# EasyEDA schematic Sheet_1.json
TITLE: Sheet_1; REV: 1.0; Date: 2023-02-18; Sheet: 1/1; Drawn By: venkatakrishnanr; Company: Your Company
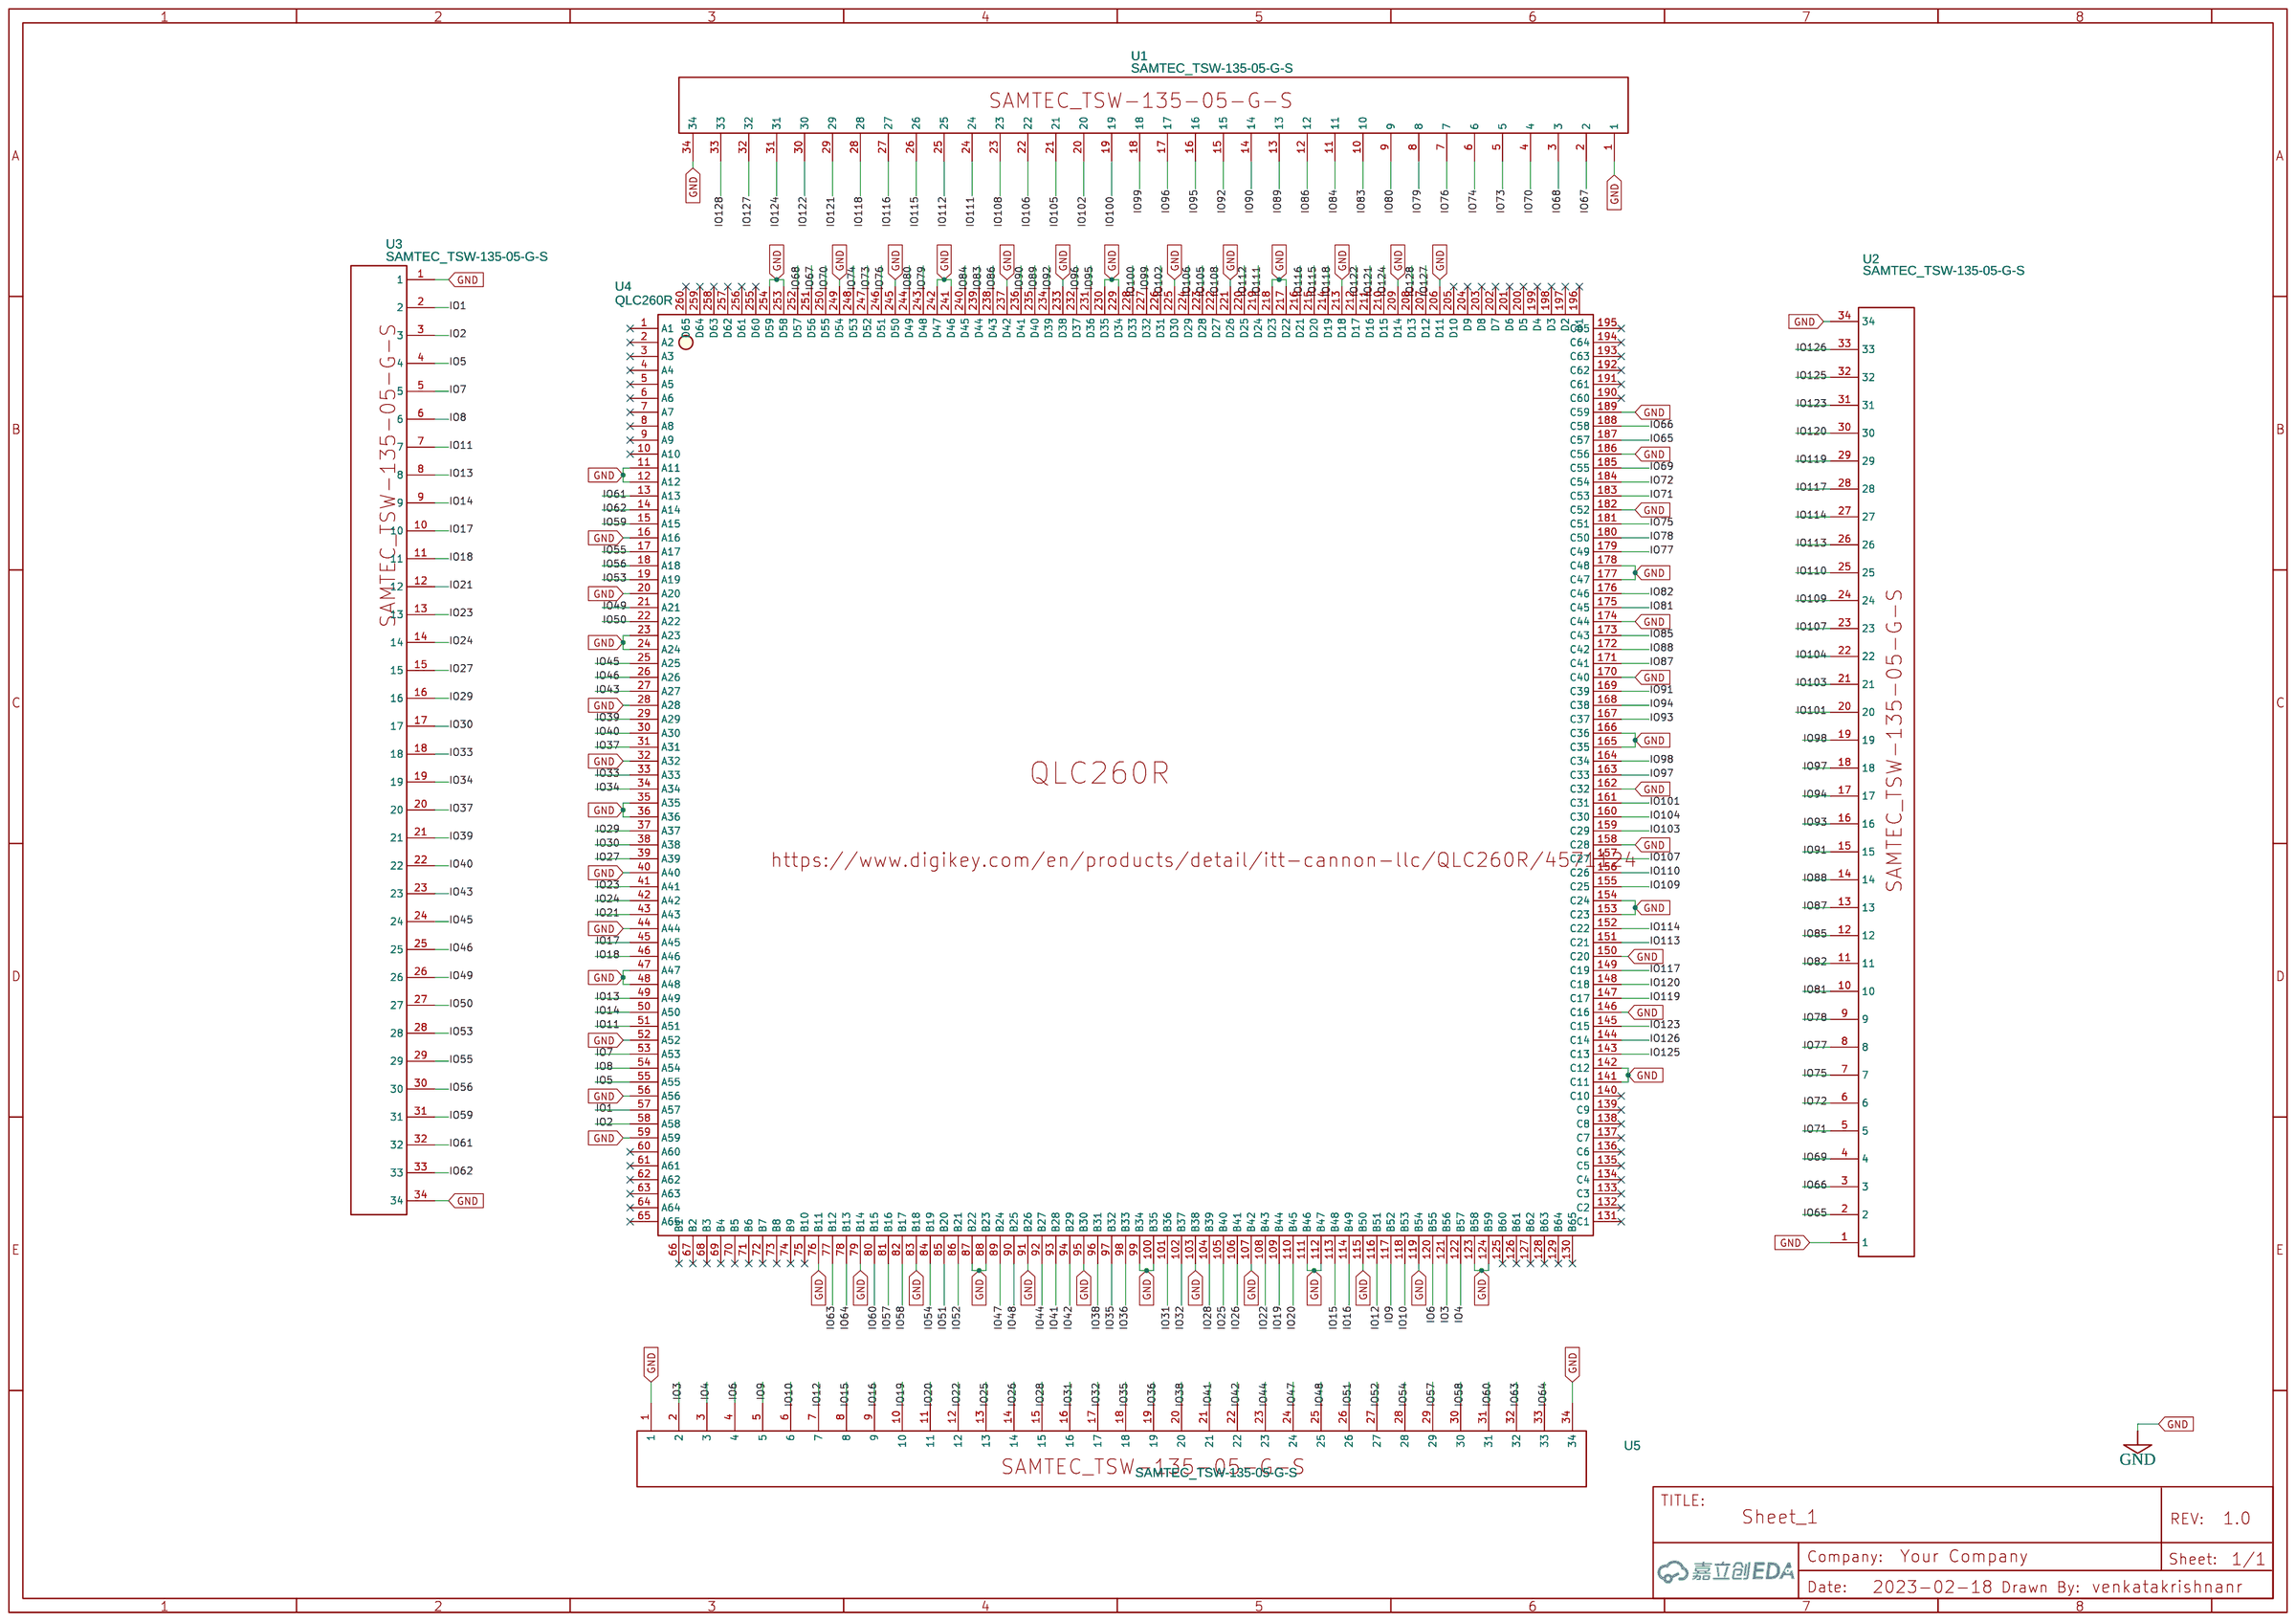
[diagram p0: schematic sheet]

## Parts
U1  SAMTEC_TSW-135-05-G-S  [CONNECTOR_01X35_SAMTECH]
U2  SAMTEC_TSW-135-05-G-S  [CONNECTOR_01X35_SAMTECH]
U3  SAMTEC_TSW-135-05-G-S  [CONNECTOR_01X35_SAMTECH]
U4  QLC260R  [QLC 260R _CONNECTOR]
U5  SAMTEC_TSW-135-05-G-S  [CONNECTOR_01X35_SAMTECH]

## Library data of the parts
U1-U3 U5 = SAMTEC_TSW-135-05-G-S: Manufacturer: Samtec Inc.; Manufacturer Part: TSW-135-05-G-S; Supplier: Digi-Key; Supplier Part: SAM1013-35-ND; link: https://www.digikey.in/en/products/detail/samtec-inc/TSW-135-05-G-S/1100486; Contributor: venkatakrishnanr
U4 = QLC260R: Manufacturer: ITT Cannon, LLC; Supplier: Digi-Key; Supplier Part: 1003-2400-ND; link: https://www.digikey.com/en/products/detail/itt-cannon-llc/QLC260R/4571124; Contributor: venkatakrishnanr

## Nets
GND: U1.1 U1.34 U2.1 U2.34 U3.1 U3.34 U4.11(A11) U4.12(A12) U4.16(A16) U4.20(A20) U4.23(A23) U4.24(A24) U4.28(A28) U4.32(A32) U4.35(A35) U4.36(A36) U4.40(A40) U4.44(A44) U4.47(A47) U4.48(A48) U4.52(A52) U4.56(A56) U4.59(A59) U4.76(B11) U4.79(B14) U4.83(B18) U4.87(B22) U4.88(B23) U4.91(B26) U4.95(B30) U4.99(B34) U4.100(B35) U4.103(B38) U4.107(B42) U4.111(B46) U4.112(B47) U4.115(B50) U4.119(B54) U4.123(B58) U4.124(B59) U4.141(C11) U4.142(C12) U4.146(C16) U4.150(C20) U4.153(C23) U4.154(C24) U4.158(C28) U4.162(C32) U4.165(C35) U4.166(C36) U4.170(C40) U4.174(C44) U4.177(C47) U4.178(C48) U4.182(C52) U4.186(C56) U4.189(C59) U4.206(D11) U4.209(D14) U4.213(D18) U4.217(D22) U4.218(D23) U4.221(D26) U4.225(D30) U4.229(D34) U4.230(D35) U4.233(D38) U4.237(D42) U4.241(D46) U4.242(D47) U4.245(D50) U4.249(D54) U4.253(D58) U4.254(D59) U5.1 U5.34
IO1: U3.2 U4.57(A57)
IO2: U3.3 U4.58(A58)
IO3: U4.121(B56) U5.2
IO4: U4.122(B57) U5.3
IO5: U3.4 U4.55(A55)
IO6: U4.120(B55) U5.4
IO7: U3.5 U4.53(A53)
IO8: U3.6 U4.54(A54)
IO9: U4.117(B52) U5.5
IO10: U4.118(B53) U5.6
IO11: U3.7 U4.51(A51)
IO12: U4.116(B51) U5.7
IO13: U3.8 U4.49(A49)
IO14: U3.9 U4.50(A50)
IO15: U4.113(B48) U5.8
IO16: U4.114(B49) U5.9
IO17: U3.10 U4.45(A45)
IO18: U3.11 U4.46(A46)
IO19: U4.109(B44) U5.10
IO20: U4.110(B45) U5.11
IO21: U3.12 U4.43(A43)
IO22: U4.108(B43) U5.12
IO23: U3.13 U4.41(A41)
IO24: U3.14 U4.42(A42)
IO25: U4.105(B40) U5.13
IO26: U4.106(B41) U5.14
IO27: U3.15 U4.39(A39)
IO28: U4.104(B39) U5.15
IO29: U3.16 U4.37(A37)
IO30: U3.17 U4.38(A38)
IO31: U4.101(B36) U5.16
IO32: U4.102(B37) U5.17
IO33: U3.18 U4.33(A33)
IO34: U3.19 U4.34(A34)
IO35: U4.97(B32) U5.18
IO36: U4.98(B33) U5.19
IO37: U3.20 U4.31(A31)
IO38: U4.96(B31) U5.20
IO39: U3.21 U4.29(A29)
IO40: U3.22 U4.30(A30)
IO41: U4.93(B28) U5.21
IO42: U4.94(B29) U5.22
IO43: U3.23 U4.27(A27)
IO44: U4.92(B27) U5.23
IO45: U3.24 U4.25(A25)
IO46: U3.25 U4.26(A26)
IO47: U4.89(B24) U5.24
IO48: U4.90(B25) U5.25
IO49: U3.26 U4.21(A21)
IO50: U3.27 U4.22(A22)
IO51: U4.85(B20) U5.26
IO52: U4.86(B21) U5.27
IO53: U3.28 U4.19(A19)
IO54: U4.84(B19) U5.28
IO55: U3.29 U4.17(A17)
IO56: U3.30 U4.18(A18)
IO57: U4.81(B16) U5.29
IO58: U4.82(B17) U5.30
IO59: U3.31 U4.15(A15)
IO60: U4.80(B15) U5.31
IO61: U3.32 U4.13(A13)
IO62: U3.33 U4.14(A14)
IO63: U4.77(B12) U5.32
IO64: U4.78(B13) U5.33
IO65: U2.2 U4.187(C57)
IO66: U2.3 U4.188(C58)
IO67: U1.2 U4.251(D56)
IO68: U1.3 U4.252(D57)
IO69: U2.4 U4.185(C55)
IO70: U1.4 U4.250(D55)
IO71: U2.5 U4.183(C53)
IO72: U2.6 U4.184(C54)
IO73: U1.5 U4.247(D52)
IO74: U1.6 U4.248(D53)
IO75: U2.7 U4.181(C51)
IO76: U1.7 U4.246(D51)
IO77: U2.8 U4.179(C49)
IO78: U2.9 U4.180(C50)
IO79: U1.8 U4.243(D48)
IO80: U1.9 U4.244(D49)
IO81: U2.10 U4.175(C45)
IO82: U2.11 U4.176(C46)
IO83: U1.10 U4.239(D44)
IO84: U1.11 U4.240(D45)
IO85: U2.12 U4.173(C43)
IO86: U1.12 U4.238(D43)
IO87: U2.13 U4.171(C41)
IO88: U2.14 U4.172(C42)
IO89: U1.13 U4.235(D40)
IO90: U1.14 U4.236(D41)
IO91: U2.15 U4.169(C39)
IO92: U1.15 U4.234(D39)
IO93: U2.16 U4.167(C37)
IO94: U2.17 U4.168(C38)
IO95: U1.16 U4.231(D36)
IO96: U1.17 U4.232(D37)
IO97: U2.18 U4.163(C33)
IO98: U2.19 U4.164(C34)
IO99: U1.18 U4.227(D32)
IO100: U1.19 U4.228(D33)
IO101: U2.20 U4.161(C31)
IO102: U1.20 U4.226(D31)
IO103: U2.21 U4.159(C29)
IO104: U2.22 U4.160(C30)
IO105: U1.21 U4.223(D28)
IO106: U1.22 U4.224(D29)
IO107: U2.23 U4.157(C27)
IO108: U1.23 U4.222(D27)
IO109: U2.24 U4.155(C25)
IO110: U2.25 U4.156(C26)
IO111: U1.24 U4.219(D24)
IO112: U1.25 U4.220(D25)
IO113: U2.26 U4.151(C21)
IO114: U2.27 U4.152(C22)
IO115: U1.26 U4.215(D20)
IO116: U1.27 U4.216(D21)
IO117: U2.28 U4.149(C19)
IO118: U1.28 U4.214(D19)
IO119: U2.29 U4.147(C17)
IO120: U2.30 U4.148(C18)
IO121: U1.29 U4.211(D16)
IO122: U1.30 U4.212(D17)
IO123: U2.31 U4.145(C15)
IO124: U1.31 U4.210(D15)
IO125: U2.32 U4.143(C13)
IO126: U2.33 U4.144(C14)
IO127: U1.32 U4.207(D12)
IO128: U1.33 U4.208(D13)

Not connected (* = marked no-connect by the designer): U4 1(A1)* 2(A2)* 3(A3)* 4(A4)* 5(A5)* 6(A6)* 7(A7)* 8(A8)* 9(A9)* 10(A10)* 60(A60)* 61(A61)* 62(A62)* 63(A63)* 64(A64)* 65(A65)* 66(B1)* 67(B2)* 68(B3)* 69(B4)* 70(B5)* 71(B6)* 72(B7)* 73(B8)* 74(B9)* 75(B10)* 125(B60)* 126(B61)* 127(B62)* 128(B63)* 129(B64)* 130(B65)* 131(C1)* 132(C2)* 133(C3)* 134(C4)* 135(C5)* 136(C6)* 137(C7)* 138(C8)* 139(C9)* 140(C10)* 190(C60)* 191(C61)* 192(C62)* 193(C63)* 194(C64)* 195(C65)* 196(D1)* 197(D2)* 198(D3)* 199(D4)* 200(D5)* 201(D6)* 202(D7)* 203(D8)* 204(D9)* 205(D10)* 255(D60)* 256(D61)* 257(D62)* 258(D63)* 259(D64)* 260(D65)*
